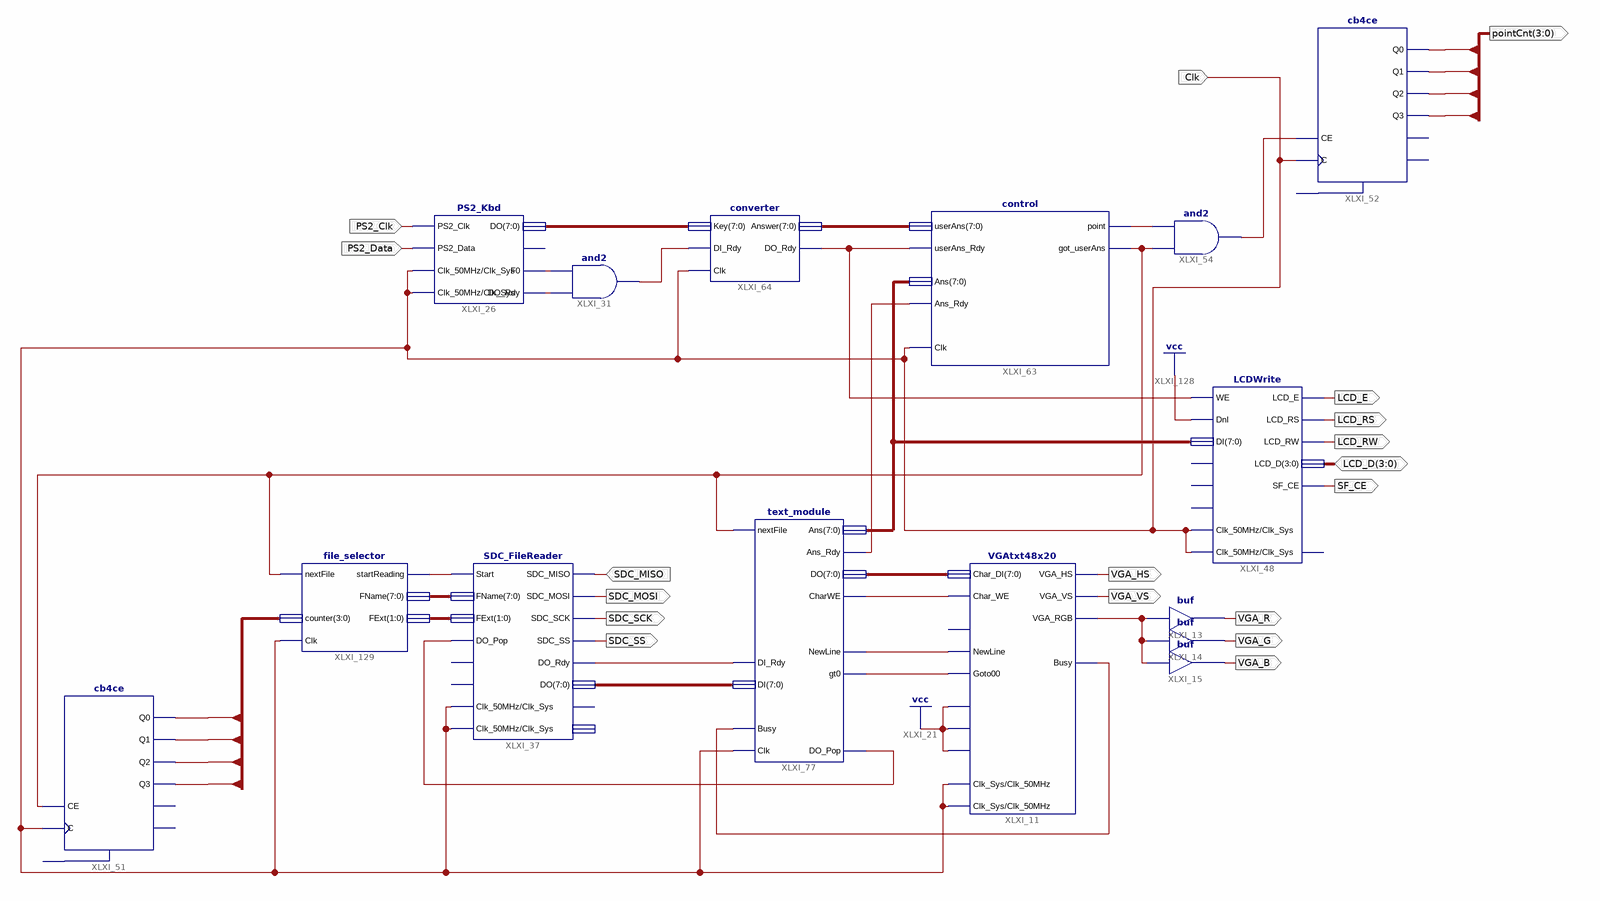
[diagram p0: schematic sheet 1]
// Xilinx ISE schematic main.sch (spartan3e) as structural Verilog: 15 symbols, 18 ports
module main (
  input  SDC_MISO,
  input  PS2_Data,
  input  PS2_Clk,
  input  Clk,
  inout  [3:0] LCD_D,
  output VGA_B,
  output VGA_G,
  output VGA_R,
  output VGA_VS,
  output VGA_HS,
  output SDC_SS,
  output SDC_SCK,
  output SDC_MOSI,
  output [3:0] pointCnt,
  output LCD_E,
  output LCD_RS,
  output LCD_RW,
  output SF_CE
);

  wire XLXN_57, XLXN_154, XLXN_155, XLXN_302, XLXN_330, XLXN_374, XLXN_417, XLXN_418, XLXN_419, XLXN_420,
       XLXN_421, XLXN_514, XLXN_519, XLXN_693, XLXN_755, XLXN_757;
  wire [1:0] XLXN_521;
  wire [3:0] counter;
  wire [7:0] XLXN_303, XLXN_349, XLXN_375, XLXN_416, XLXN_513, XLXN_520;

  buf XLXI_15 (VGA_B, XLXN_57);
  buf XLXI_14 (VGA_G, XLXN_57);
  buf XLXI_13 (VGA_R, XLXN_57);
  VGAtxt48x20 XLXI_11 (
    .Char_DI(XLXN_416), .NewLine(XLXN_418), .Goto00(XLXN_419), .Clk_Sys(Clk), .Clk_50MHz(Clk),
    .CursorOn(1'b1), .ScrollEn(1'b1), .ScrollClear(1'b1), .Busy(XLXN_421), .VGA_HS(VGA_HS), .VGA_VS(VGA_VS),
    .VGA_RGB(XLXN_57), .Char_WE(XLXN_417));  // open: Home
  text_module XLXI_77 (
    .Clk(Clk), .nextFile(XLXN_757), .Busy(XLXN_421), .DI_Rdy(XLXN_374), .DI(XLXN_375), .Ans(XLXN_513),
    .Ans_Rdy(XLXN_514), .DO(XLXN_416), .CharWE(XLXN_417), .DO_Pop(XLXN_420), .NewLine(XLXN_418),
    .gt0(XLXN_419));
  SDC_FileReader XLXI_37 (
    .SDC_MISO(SDC_MISO), .Start(XLXN_519), .FName(XLXN_520), .Clk_50MHz(Clk), .DO_Pop(XLXN_420),
    .SDC_MOSI(SDC_MOSI), .SDC_SCK(SDC_SCK), .SDC_SS(SDC_SS), .DO(XLXN_375), .DO_Rdy(XLXN_374),
    .FExt(XLXN_521), .Clk_Sys(Clk));  // open: Reset, Abort, Error, Busy
  file_selector XLXI_129 (
    .Clk(Clk), .nextFile(XLXN_757), .startReading(XLXN_519), .FName(XLXN_520), .FExt(XLXN_521),
    .counter(counter));
  cb4ce XLXI_51 (
    .C(Clk), .CE(XLXN_757), .Q0(counter[0]), .Q1(counter[1]), .Q2(counter[2]), .Q3(counter[3]));  // open: CLR, CEO, TC
  cb4ce XLXI_52 (
    .C(Clk), .CE(XLXN_693), .Q0(pointCnt[0]), .Q1(pointCnt[1]), .Q2(pointCnt[2]), .Q3(pointCnt[3]));  // open: CLR, CEO, TC
  control XLXI_63 (
    .got_userAns(XLXN_757), .point(XLXN_330), .Clk(Clk), .userAns(XLXN_349), .userAns_Rdy(XLXN_755),
    .Ans_Rdy(XLXN_514), .Ans(XLXN_513));
  and XLXI_54 (XLXN_693, XLXN_757, XLXN_330);
  LCDWrite XLXI_48 (
    .WE(XLXN_755), .DnI(1'b1), .DI(XLXN_513), .LCD_E(LCD_E), .LCD_RS(LCD_RS), .LCD_RW(LCD_RW), .LCD_D(LCD_D),
    .SF_CE(SF_CE), .Clk_50MHz(Clk), .Clk_Sys(Clk));  // open: Reset, Cursor, Blink, Busy
  converter XLXI_64 (.DI_Rdy(XLXN_302), .Clk(Clk), .Key(XLXN_303), .Answer(XLXN_349), .DO_Rdy(XLXN_755));
  and XLXI_31 (XLXN_302, XLXN_155, XLXN_154);
  PS2_Kbd XLXI_26 (
    .PS2_Clk(PS2_Clk), .PS2_Data(PS2_Data), .Clk_50MHz(Clk), .F0(XLXN_154), .DO_Rdy(XLXN_155), .DO(XLXN_303),
    .Clk_Sys(Clk));  // open: E0
endmodule
